# Altium schematic sheet VOUT_1-3V.SchDoc
size A4; SheetNumber: 4; SheetTotal: 8
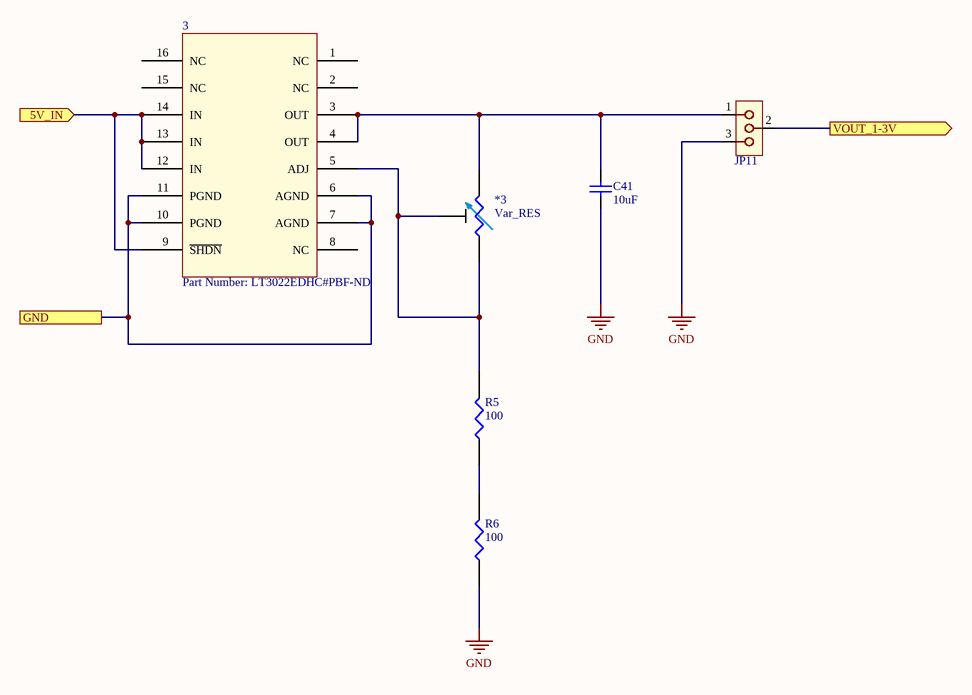
[diagram p0: VOUT_1-3V.SchDoc]

## Parts
3  Part Number: LT3022EDHC#PBF-ND  [LT3022]
*3  Var_RES  [res_var_5turn]
C41  10uF  [C0805]
JP11  Jumper  [01x03_0.1in_th_straight_b_nom]  (value not drawn)
R5  100  [R0805]
R6  100  [R0805]

## Ports
5V_IN (in), GND, VOUT_1-3V (out)

## Nets
GND: C41.1 JP11.3 R6.1
5V_IN: 3.9(~{SHDN}) 3.12(IN) 3.13(IN) 3.14(IN) ; port 5V_IN
GND: 3.6(AGND) 3.7(AGND) 3.10(PGND) 3.11(PGND) ; port GND  [a separate net that carries the same name]
VOUT_1-3V: JP11.2 ; port VOUT_1-3V
Net3_3: 3.3(OUT) 3.4(OUT) *3.3 C41.2 JP11.1
Net3_5: 3.5(ADJ) *3.1 *3.2 R5.2
NetR5_1: R5.1 R6.2

Not connected (* = marked no-connect by the designer): 3 1(NC) 2(NC) 8(NC) 15(NC) 16(NC)

## Library data of the parts
3 = LT3022: Linear Voltage Regulator IC Positive Adjustable 1 Output 1A 16-DFN (5x3)
C41 = Cap 10uF: Manufacturer: Taiyo Yuden; Manufacturer Part Number: UMK212SD103KD-T; Dielectric Material: Ceramic; Capacitance: 10nF; Tolerance: 10%; Voltage Rating: 50V; Supplier 1: Digi-Key; Stock 1: 14125; Pricing 1: 1=0.47, 10=0.323, 100=0.1941, 500=0.1455, 1000=0.1229 (USD); Mount: Surface Mount; Case/Package: 0805; Number of Pins: 2; Case Code (Metric): 2012; Case Code (Imperial): 0805; Min Operating Temperature: -55°C; Max Operating Temperature: 125°C; Packaging: Tape and Reel; Package Quantity: 1; Voltage Rating (DC): 50V; Termination: SMD/SMT; Length: 2mm; Height: 0.85mm; Width: 0.049inch; Thickness: 0.037inch; Depth: 1.25mm; Radiation Hardening: No; Lead Free: Lead Free; Halogen Free: Halogen Free; ComponentLink1URL: https://datasheet.ciiva.com/138/umk212sd103kd-t-ss-138661.pdf; ComponentLink1Description: https://datasheet.ciiva.com/138/umk212sd103kd-t-ss-138661.pdf; ComponentLink2URL: https://datasheet.ciiva.com/138/mlcc07-e-138662.pdf; ComponentLink2Description: https://datasheet.ciiva.com/138/mlcc07-e-138662.pdf; ComponentLink3URL: https://datasheet.ciiva.com/138/mlcc07-e-138663.pdf; ComponentLink3Description: https://datasheet.ciiva.com/138/mlcc07-e-138663.pdf; ComponentLink4URL: https://datasheet.ciiva.com/30140/303umk212sd103kd-t-30140925.pdf; ComponentLink4Description: https://datasheet.ciiva.com/30140/303umk212sd103kd-t-30140925.pdf; Supplier Part Number 1: 587-1114-1-ND
JP11 = Jumper-01x03: 01X03 generic terminal connector
R5 R6 = Res 100